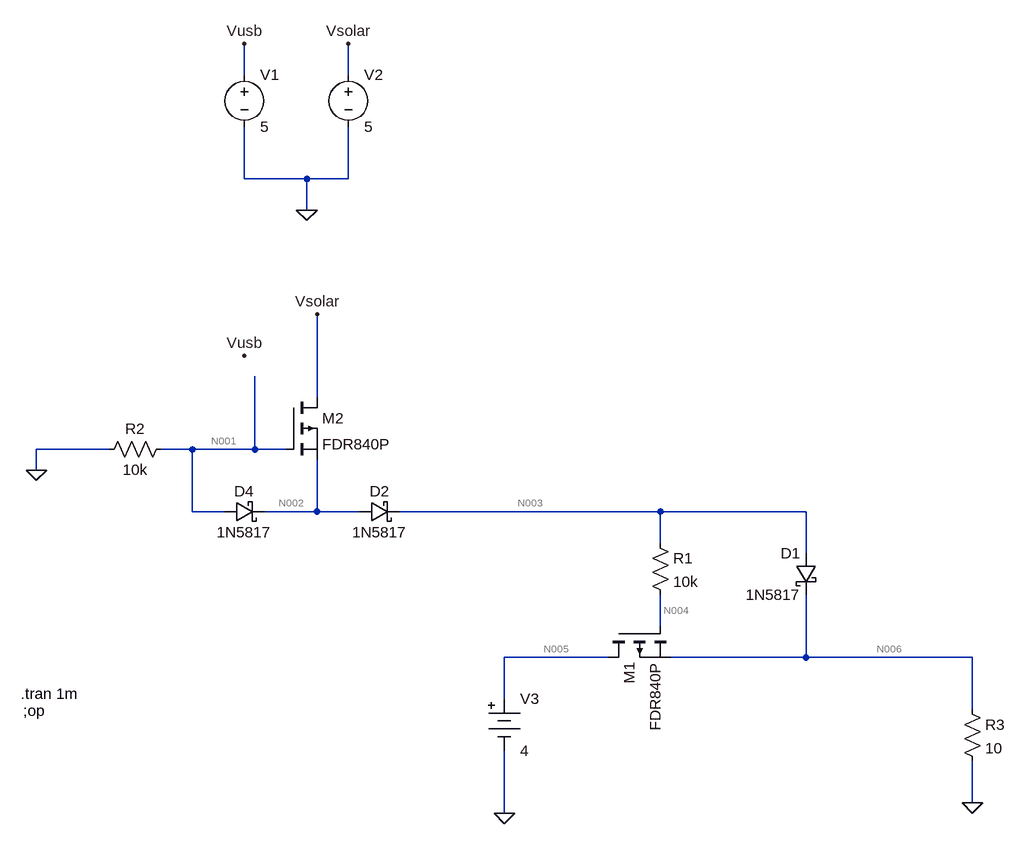
[diagram p0: schematic powerpath_andre.asc]
powerpath_andre.asc, the LTspice schematic file:
Version 4
SHEET 1 880 680
WIRE -560 -560 -560 -608
WIRE -400 -560 -400 -608
WIRE -560 -400 -560 -480
WIRE -464 -400 -560 -400
WIRE -400 -400 -400 -480
WIRE -400 -400 -464 -400
WIRE -464 -352 -464 -400
WIRE -448 -64 -448 -192
WIRE -768 16 -880 16
WIRE -640 16 -688 16
WIRE -544 16 -544 -96
WIRE -544 16 -640 16
WIRE -496 16 -544 16
WIRE -880 48 -880 16
WIRE -640 112 -640 16
WIRE -592 112 -640 112
WIRE -448 112 -448 32
WIRE -448 112 -528 112
WIRE -384 112 -448 112
WIRE 80 112 -320 112
WIRE 304 112 80 112
WIRE 80 160 80 112
WIRE 304 176 304 112
WIRE 80 288 80 240
WIRE 0 336 -160 336
WIRE 304 336 304 240
WIRE 304 336 96 336
WIRE 560 336 304 336
WIRE -160 400 -160 336
WIRE 560 416 560 336
WIRE 560 560 560 496
WIRE -160 576 -160 480
FLAG -464 -352 0
FLAG -560 -608 Vusb
FLAG -400 -608 Vsolar
FLAG -560 -128 Vusb
FLAG -448 -192 Vsolar
FLAG -880 48 0
FLAG -160 576 0
FLAG 560 560 0
SYMBOL voltage -560 -576 R0
WINDOW 123 0 0 Left 0
WINDOW 39 0 0 Left 0
SYMATTR InstName V1
SYMATTR Value 5
SYMBOL voltage -400 -576 R0
WINDOW 123 0 0 Left 0
WINDOW 39 0 0 Left 0
SYMATTR InstName V2
SYMATTR Value 5
SYMBOL pmos -496 -64 R0
SYMATTR InstName M2
SYMATTR Value FDR840P
SYMBOL schottky -592 96 M90
WINDOW 0 0 32 VBottom 2
WINDOW 3 32 32 VTop 2
SYMATTR InstName D4
SYMATTR Value 1N5817
SYMBOL res -672 0 R90
WINDOW 0 0 56 VBottom 2
WINDOW 3 32 56 VTop 2
SYMATTR InstName R2
SYMATTR Value 10k
SYMBOL pmos 0 288 M90
SYMATTR InstName M1
SYMATTR Value FDR840P
SYMBOL Misc\\battery -160 384 R0
WINDOW 123 0 0 Left 0
WINDOW 39 0 0 Left 0
SYMATTR InstName V3
SYMATTR Value 4
SYMBOL res 64 144 R0
SYMATTR InstName R1
SYMATTR Value 10k
SYMBOL schottky 320 176 M0
SYMATTR InstName D1
SYMATTR Value 1N5817
SYMBOL res 544 400 R0
SYMATTR InstName R3
SYMATTR Value 10
SYMBOL schottky -384 96 M90
WINDOW 0 0 32 VBottom 2
WINDOW 3 32 32 VTop 2
SYMATTR InstName D2
SYMATTR Value 1N5817
TEXT -900 418 Left 2 !;op
TEXT -904 392 Left 2 !.tran 1m

The netlist it stands for:
* powerpath_andre.asc
V1 Vusb 0 5
V2 Vsolar 0 5
M2 Vsolar N001 N002 N002 FDR840P
D4 N001 N002 1N5817
R2 N001 0 10k
M1 N005 N004 N006 N006 FDR840P
V3 N005 0 4
R1 N003 N004 10k
D1 N003 N006 1N5817
R3 N006 0 10
D2 N002 N003 1N5817
.model D D
.lib standard.dio
.model NMOS NMOS
.model PMOS PMOS
.lib standard.mos
;op
.tran 1m
.backanno
.end

* Results of the author's LTspice run, read from the files saved beside the schematic
* Operating Point, zero values left out:
*   V(vusb) = 5 V
*   V(vsolar) = 5 V
*   V(n001) = 317 mV
*   V(n002) = 4.995 V
*   V(n005) = 4 V
*   V(n004) = 4.636 V
*   V(n006) = 4.276 V
*   V(n003) = 4.636 V
*   Id(M1) = -85.04 pA
*   Is(M1) = 85.04 pA
*   Id(M2) = 427.6 mA
*   Is(M2) = -427.6 mA
*   I(D2) = 427.6 mA
*   I(D1) = 427.6 mA
*   I(D4) = -31.7 µA
*   I(R3) = 427.6 mA
*   I(R2) = 31.7 µA
*   I(V3) = 85.38 pA
*   I(V2) = -427.6 mA